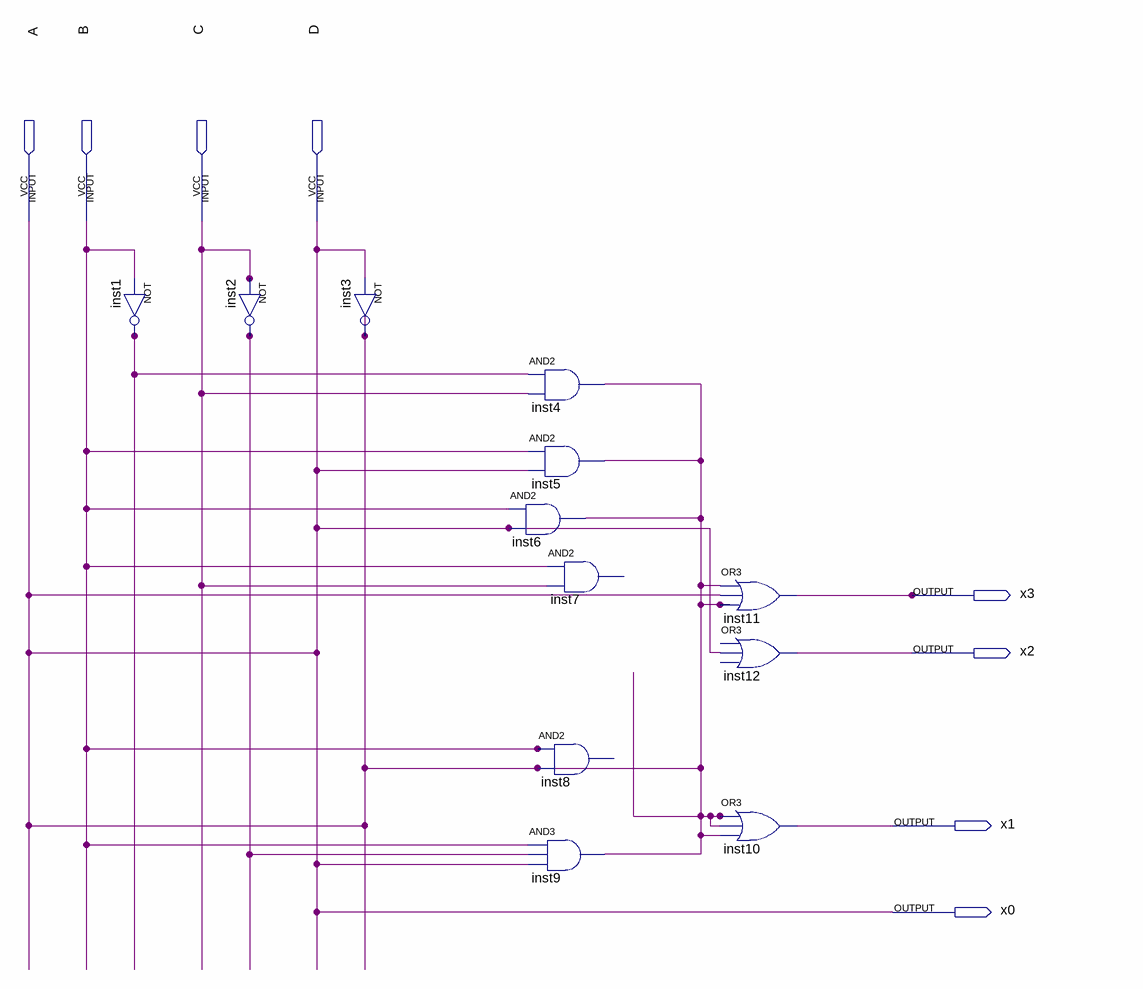
[diagram p0: schematic sheet]
// Quartus schematic BCDto2421.bdf as structural Verilog: 12 symbols, 8 pins
module BCDto2421 (
  input  A,
  input  B,
  input  C,
  input  D,
  output x3,
  output x2,
  output x1,
  output x0
);

  wire inst1_out, inst2_out;

  not inst1 (inst1_out, B);
  not inst2 (inst2_out, C);
  not inst3 (A, A);
  and inst4 (A, inst1_out, C);
  and inst5 (A, B, A);
  and inst6 (A, B, A);
  // AND2 inst7 has open pins: IN1=B, IN2=C, OUT=open
  // AND2 inst8 has open pins: IN1=B, IN2=A, OUT=open
  and inst9 (A, B, inst2_out, A);
  or inst11 (x3, A, A, A);
  buf inst12 (x2, A);  // OR3 open: IN1, IN3
  or inst10 (x1, A, A, A);

  assign D = A;
  assign x0 = A;
endmodule
